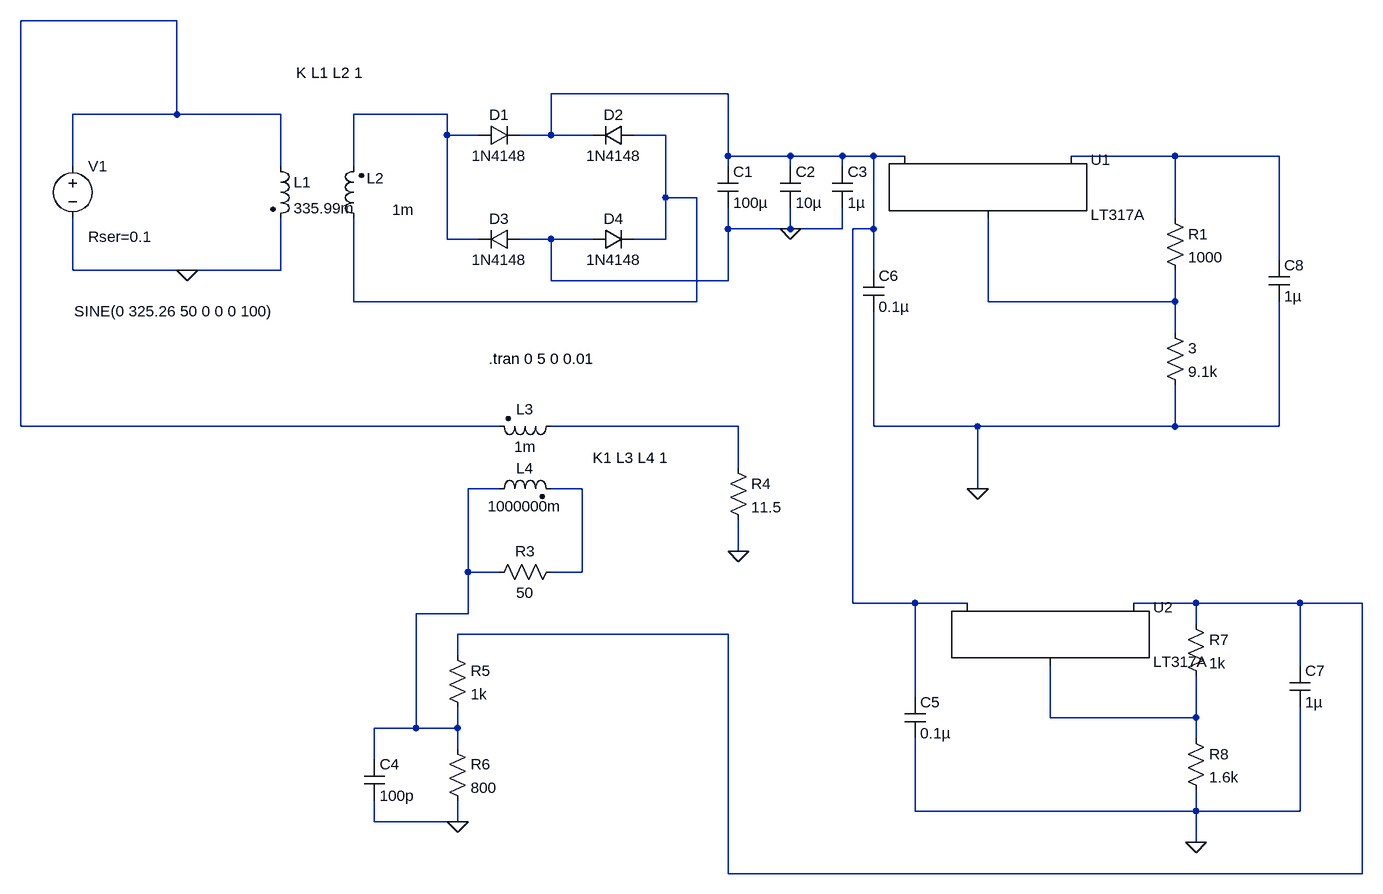
[diagram p0: schematic Draft6.asc]
Draft6.asc, the LTspice schematic file:
Version 4
SHEET 1 880 1380
WIRE -1056 -80 -1296 -80
WIRE -208 32 -480 32
WIRE -1056 64 -1056 -80
WIRE -1056 64 -1216 64
WIRE -896 64 -1056 64
WIRE -640 64 -784 64
WIRE -640 96 -640 64
WIRE -592 96 -640 96
WIRE -480 96 -480 32
WIRE -480 96 -528 96
WIRE -416 96 -480 96
WIRE -304 96 -352 96
WIRE -208 128 -208 32
WIRE -112 128 -208 128
WIRE -32 128 -112 128
WIRE 16 128 -32 128
WIRE 64 128 16 128
WIRE 480 128 320 128
WIRE 640 128 480 128
WIRE -1216 144 -1216 64
WIRE -896 144 -896 64
WIRE -784 144 -784 64
WIRE -208 144 -208 128
WIRE -112 144 -112 128
WIRE -32 144 -32 128
WIRE -304 192 -304 96
WIRE -256 192 -304 192
WIRE 480 224 480 128
WIRE -208 240 -208 208
WIRE -112 240 -112 208
WIRE -112 240 -208 240
WIRE -32 240 -32 208
WIRE -32 240 -112 240
WIRE 16 240 16 128
WIRE 16 240 -16 240
WIRE -640 256 -640 96
WIRE -592 256 -640 256
WIRE -480 256 -528 256
WIRE -416 256 -480 256
WIRE -304 256 -304 192
WIRE -304 256 -352 256
WIRE 640 288 640 128
WIRE -1216 304 -1216 224
WIRE -1040 304 -1216 304
WIRE -896 304 -896 224
WIRE -896 304 -1040 304
WIRE 16 304 16 240
WIRE -480 320 -480 256
WIRE -208 320 -208 240
WIRE -208 320 -480 320
WIRE -784 352 -784 224
WIRE -256 352 -256 192
WIRE -256 352 -784 352
WIRE 192 352 192 224
WIRE 480 352 480 304
WIRE 480 352 192 352
WIRE 480 400 480 352
WIRE -1296 544 -1296 -80
WIRE -560 544 -1296 544
WIRE -192 544 -480 544
WIRE 16 544 16 368
WIRE 176 544 16 544
WIRE 480 544 480 480
WIRE 480 544 176 544
WIRE 640 544 640 352
WIRE 640 544 480 544
WIRE -192 608 -192 544
WIRE -560 640 -608 640
WIRE -432 640 -480 640
WIRE 176 640 176 544
WIRE -192 736 -192 688
WIRE -608 768 -608 640
WIRE -560 768 -608 768
WIRE -432 768 -432 640
WIRE -432 768 -480 768
WIRE -16 816 -16 240
WIRE 80 816 -16 816
WIRE 160 816 80 816
WIRE 512 816 416 816
WIRE 672 816 512 816
WIRE 768 816 672 816
WIRE -608 832 -608 768
WIRE -608 832 -688 832
WIRE 512 848 512 816
WIRE -208 864 -624 864
WIRE -624 896 -624 864
WIRE 672 912 672 816
WIRE 80 960 80 816
WIRE 288 992 288 912
WIRE 512 992 512 928
WIRE 512 992 288 992
WIRE -688 1008 -688 832
WIRE -688 1008 -752 1008
WIRE -624 1008 -624 976
WIRE -624 1008 -688 1008
WIRE 512 1024 512 992
WIRE -624 1040 -624 1008
WIRE -752 1056 -752 1008
WIRE 80 1136 80 1024
WIRE 512 1136 512 1104
WIRE 512 1136 80 1136
WIRE 672 1136 672 976
WIRE 672 1136 512 1136
WIRE -752 1152 -752 1120
WIRE -624 1152 -624 1120
WIRE -624 1152 -752 1152
WIRE 512 1184 512 1136
WIRE -208 1232 -208 864
WIRE 768 1232 768 816
WIRE 768 1232 -208 1232
FLAG 176 640 0
FLAG -1040 304 0
FLAG -112 240 0
FLAG -192 736 0
FLAG -624 1152 0
FLAG 512 1184 0
SYMBOL PowerProducts\\LT317A 192 128 R0
SYMATTR InstName U1
SYMBOL res 464 208 R0
SYMATTR InstName R1
SYMATTR Value 1000
SYMBOL res 464 384 R0
SYMATTR InstName 3
SYMATTR Value 9.1k
SYMBOL diode -592 112 R270
WINDOW 0 32 32 VTop 2
WINDOW 3 0 32 VBottom 2
SYMATTR InstName D1
SYMATTR Value 1N4148
SYMBOL diode -352 80 R90
WINDOW 0 0 32 VBottom 2
WINDOW 3 32 32 VTop 2
SYMATTR InstName D2
SYMATTR Value 1N4148
SYMBOL diode -528 240 R90
WINDOW 0 0 32 VBottom 2
WINDOW 3 32 32 VTop 2
SYMATTR InstName D3
SYMATTR Value 1N4148
SYMBOL diode -416 272 R270
WINDOW 0 32 32 VTop 2
WINDOW 3 0 32 VBottom 2
SYMATTR InstName D4
SYMATTR Value 1N4148
SYMBOL cap -224 144 R0
SYMATTR InstName C1
SYMATTR Value 100µ
SYMBOL cap -128 144 R0
SYMATTR InstName C2
SYMATTR Value 10µ
SYMBOL cap -48 144 R0
SYMATTR InstName C3
SYMATTR Value 1µ
SYMBOL voltage -1216 128 R0
WINDOW 3 2 239 Left 2
WINDOW 123 0 0 Left 0
WINDOW 39 24 124 Left 2
SYMATTR Value SINE(0 325.26 50 0 0 0 100)
SYMATTR SpiceLine Rser=0.1
SYMATTR InstName V1
SYMBOL ind2 -912 128 R0
SYMATTR InstName L1
SYMATTR Value 335.99m
SYMATTR Type ind
SYMBOL ind2 -768 240 R180
WINDOW 0 -31 78 Left 2
WINDOW 3 -77 29 Left 2
SYMATTR InstName L2
SYMATTR Value 1m
SYMATTR Type ind
SYMBOL ind2 -464 528 R90
WINDOW 0 5 56 VBottom 2
WINDOW 3 32 56 VTop 2
SYMATTR InstName L3
SYMATTR Value 1m
SYMATTR Type ind
SYMBOL ind2 -576 656 R270
WINDOW 0 32 56 VTop 2
WINDOW 3 5 56 VBottom 2
SYMATTR InstName L4
SYMATTR Value 1000000m
SYMATTR Type ind
SYMBOL res -464 752 R90
WINDOW 0 0 56 VBottom 2
WINDOW 3 32 56 VTop 2
SYMATTR InstName R3
SYMATTR Value 50
SYMBOL res -208 592 R0
SYMATTR InstName R4
SYMATTR Value 11.5
SYMBOL res -640 880 R0
SYMATTR InstName R5
SYMATTR Value 1k
SYMBOL res -640 1024 R0
SYMATTR InstName R6
SYMATTR Value 800
SYMBOL cap -768 1056 R0
SYMATTR InstName C4
SYMATTR Value 100p
SYMBOL PowerProducts\\LT317A 288 816 R0
SYMATTR InstName U2
SYMBOL res 496 832 R0
SYMATTR InstName R7
SYMATTR Value 1k
SYMBOL res 496 1008 R0
SYMATTR InstName R8
SYMATTR Value 1.6k
SYMBOL cap 64 960 R0
SYMATTR InstName C5
SYMATTR Value 0.1µ
SYMBOL cap 656 912 R0
SYMATTR InstName C7
SYMATTR Value 1µ
SYMBOL cap 624 288 R0
SYMATTR InstName C8
SYMATTR Value 1µ
SYMBOL cap 0 304 R0
SYMATTR InstName C6
SYMATTR Value 0.1µ
TEXT -576 440 Left 2 !.tran 0 5 0 0.01
TEXT -872 0 Left 2 !K L1 L2 1
TEXT -416 592 Left 2 !K1 L3 L4 1

The netlist it stands for:
* Draft6.asc
XU1 N006 N005 N002 LT317A
R1 N005 N006 1000
R§3 N006 0 9.1k
D1 N003 N002 1N4148
D2 N004 N002 1N4148
D3 0 N003 1N4148
D4 0 N004 1N4148
C1 N002 0 100µ
C2 N002 0 10µ
C3 N002 0 1µ
V1 N001 0 SINE(0 325.26 50 0 0 0 100) Rser=0.1
L1 N001 0 335.99m
L2 N004 N003 1m
L3 N007 N001 1m
L4 N008 N009 1000000m
R3 N009 N008 50
R4 N007 0 11.5
R5 N010 N008 1k
R6 N008 0 800
C4 N008 0 100p
XU2 N011 N010 N002 LT317A
R7 N010 N011 1k
R8 N011 0 1.6k
C5 N002 0 0.1µ
C7 N010 0 1µ
C8 N005 0 1µ
C6 N002 0 0.1µ
.model D D
.lib standard.dio
.tran 0 5 0 0.01
K L1 L2 1
K1 L3 L4 1
.lib LTC.lib
.backanno
.end